# Altium project USB_FPGA_SLM_v2.PrjPcb
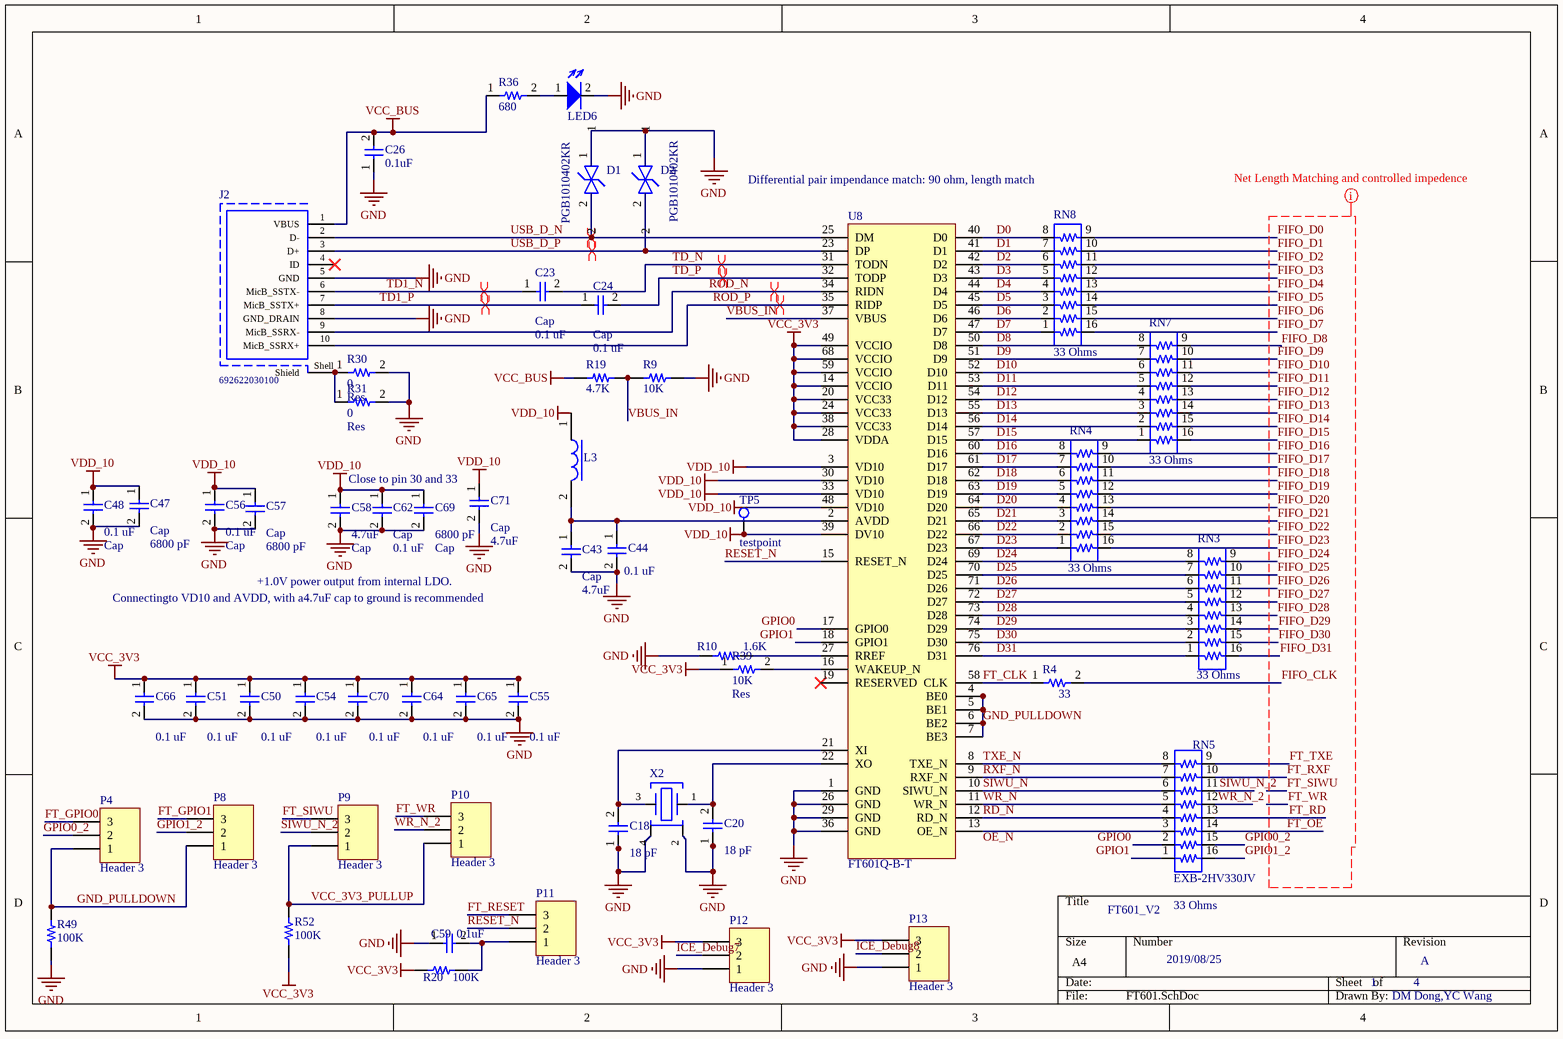
[diagram p0: FT601.SchDoc]
=Title: FPGA
3 sheets, 146 parts. Net scope: global (net labels, ports and power ports of the same name join across sheets).
Board file: PCB_Rev1.1.PcbDoc
Sheets:
  FT601.SchDoc
  FPGA_SLM.SchDoc
  FPGA_Power_SPI.SchDoc

## Sheet FT601.SchDoc: FT601_V2
size A4; Date: 2019/08/25; CheckedBy: A Kadis; Author: DM Dong,YC Wang; CompanyName: CMMPE; DrawnBy: Daoming Dong, Youchao Wang; Revision: A; SheetNumber: 1; SheetTotal: 4

### Parts
C18  value 18 pF  [CAP_18pF_0603]  (hidden comment: C0603C180K5RACAUTO)
C20  value 18 pF  [CAP_18pF_0603]  (hidden comment: C0603C180K5RACAUTO)
C23  value 0.1 uF  Component Name: Cap  [Cap_0.1uF_0402]  (hidden comment: CC0402KPX5R6BB104)
C24  value 0.1 uF  Component Name: Cap  [Cap_0.1uF_0402]  (hidden comment: CC0402KPX5R6BB104)
C26  value 0.1uF  [Cap_0.1uF]  (hidden comment: AC0603KRX7R9BB104)
C43  value 4.7uF  Component Name: Cap  [CAP_4.7uF_0402]  (hidden comment: C1005X5R0J475K050BC)
C44  value 0.1 uF  [Cap_0.1uF_0402]  (hidden comment: CC0402KPX5R6BB104)
C47  value 6800 pF  Component Name: Cap  [CAP_6700pF_0402]  (hidden comment: C0402C682K5RECAUTO)
C48  value 0.1 uF  Component Name: Cap  [Cap_0.1uF_0402]  (hidden comment: CC0402KPX5R6BB104)
C50  value 0.1 uF  [Cap_0.1uF_0402]  (hidden comment: CC0402KPX5R6BB104)
C51  value 0.1 uF  [Cap_0.1uF_0402]  (hidden comment: CC0402KPX5R6BB104)
C54  value 0.1 uF  [Cap_0.1uF_0402]  (hidden comment: CC0402KPX5R6BB104)
C55  value 0.1 uF  [Cap_0.1uF_0402]  (hidden comment: CC0402KPX5R6BB104)
C56  value 0.1 uF  Component Name: Cap  [Cap_0.1uF_0402]  (hidden comment: CC0402KPX5R6BB104)
C57  value 6800 pF  Component Name: Cap  [CAP_6700pF_0402]  (hidden comment: C0402C682K5RECAUTO)
C58  value 4.7uF  Component Name: Cap  [CAP_4.7uF_0402]  (hidden comment: C1005X5R0J475K050BC)
C59  value 0.1uF  [Cap_0.1uF]  (hidden comment: AC0603KRX7R9BB104)
C62  value 0.1 uF  Component Name: Cap  [Cap_0.1uF_0402]  (hidden comment: CC0402KPX5R6BB104)
C64  value 0.1 uF  [Cap_0.1uF_0402]  (hidden comment: CC0402KPX5R6BB104)
C65  value 0.1 uF  [Cap_0.1uF_0402]  (hidden comment: CC0402KPX5R6BB104)
C66  value 0.1 uF  [Cap_0.1uF_0402]  (hidden comment: CC0402KPX5R6BB104)
C69  value 6800 pF  Component Name: Cap  [CAP_6700pF_0402]  (hidden comment: C0402C682K5RECAUTO)
C70  value 0.1 uF  [Cap_0.1uF_0402]  (hidden comment: CC0402KPX5R6BB104)
C71  value 4.7uF  Component Name: Cap  [CAP_4.7uF_0402]  (hidden comment: C1005X5R0J475K050BC)
D1  PGB1010402KR  [ESD_Suppressor]
D2  PGB1010402KR  [ESD_Suppressor]
J2  692622030100  [692622030100]
L3  BLM18PG300SZ1D  [FerriteBeads]  (value not drawn)
LED6  TLMS1000-GS08  [LED_RED]  (value not drawn)
P4  Header 3  [HDR1X3]
P8  Header 3  [HDR1X3]
P9  Header 3  [HDR1X3]
P10  Header 3  [HDR1X3]
P11  Header 3  [HDR1X3]
P12  Header 3  [HDR1X3]
P13  Header 3  [HDR1X3]
R4  value 33  [Res_33_0402]  (hidden comment: ERJ2RKD33R0X)
R9  value 10K  [RES_10K]  (hidden comment: RT0603WRE0710KL)
R10  value 1.6K  [RES_1.6K]  (hidden comment: ERJ-3RBD1601V)
R19  value 4.7K  [RES_4.7K]  (hidden comment: AC0603JR-134K7L)
R20  value 100K  [RES_100K]  (hidden comment: SR0603KR-07100KL)
R30  value 0  Component Name: Res  [RES_0]  (hidden comment: CRCW06030000Z0EAC)
R31  value 0  Component Name: Res  [RES_0]  (hidden comment: CRCW06030000Z0EAC)
R36  value 680  [RES_680]  (hidden comment: RT0603FRE13680RL)
R39  value 10K  Component Name: Res  [RES_10K]  (hidden comment: RT0603WRE0710KL)
R49  value 100K  [RESC1607X60N]  (hidden comment: SR0603KR-07100KL)
R52  value 100K  [RESC1607X60N]  (hidden comment: SR0603KR-07100KL)
RN3  value 33 Ohms  [ResArray_0]  (hidden comment: EXB-2HV330JV)
RN4  value 33 Ohms  [ResArray_0]  (hidden comment: EXB-2HV330JV)
RN5  EXB-2HV330JV  value 33 Ohms  [ResArray_0]
RN7  value 33 Ohms  [ResArray_0]  (hidden comment: EXB-2HV330JV)
RN8  value 33 Ohms  [ResArray_0]  (hidden comment: EXB-2HV330JV)
TP5  testpoint  [testpoint]
U8  FT601Q-B-T  [FT601_NoGND_Pad]
X2  ABM8G-30.000MHZ-18-D2Y-T  [30MHzOscillatorV2]  (value not drawn)

### Nets
GND: C18.1 C20.1 C26.1 C43.2 C44.2 C47.2 C48.2 C50.2 C51.2 C54.2 C55.2 C56.2 C57.2 C58.2 C59.1 C62.2 C64.2 C65.2 C66.2 C69.2 C70.2 C71.2 D1.1 D2.1 J2.5(GND) J2.8(GND_DRAIN) LED6.2(Cathode) P12.1 P13.1 R9.1 R10.1 R30.2 R31.2 R49.1 U8.1(GND) U8.26(GND) U8.29(GND) U8.36(GND) X2.2(GND) X2.4(GND)
VCC_3V3: C50.1 C51.1 C54.1 C55.1 C64.1 C65.1 C66.1 C70.1 P12.3 P13.3 R20.1 R39.1 R52.1 U8.14(VCCIO) U8.20(VCC33) U8.24(VCC33) U8.28(VDDA) U8.38(VCC33) U8.49(VCCIO) U8.59(VCCIO) U8.68(VCCIO)
VCC_BUS: C26.2 J2.1(VBUS) R19.2 R36.1
VDD_10: C47.1 C48.1 C56.1 C57.1 C58.1 C62.1 C69.1 C71.1 L3.1 TP5.1 U8.3(VD10) U8.30(VD10) U8.33(VD10) U8.39(DV10) U8.48(VD10)
D0: RN8.8 U8.40(D0)
D1: RN8.7 U8.41(D1)
D2: RN8.6 U8.42(D2)
D3: RN8.5 U8.43(D3)
D4: RN8.4 U8.44(D4)
D5: RN8.3 U8.45(D5)
D6: RN8.2 U8.46(D6)
D7: RN8.1 U8.47(D7)
D8: RN7.8 U8.50(D8)
D9: RN7.7 U8.51(D9)
D10: RN7.6 U8.52(D10)
D11: RN7.5 U8.53(D11)
D12: RN7.4 U8.54(D12)
D13: RN7.3 U8.55(D13)
D14: RN7.2 U8.56(D14)
D15: RN7.1 U8.57(D15)
D16: RN4.8 U8.60(D16)
D17: RN4.7 U8.61(D17)
D18: RN4.6 U8.62(D18)
D19: RN4.5 U8.63(D19)
D20: RN4.4 U8.64(D20)
D21: RN4.3 U8.65(D21)
D22: RN4.2 U8.66(D22)
D23: RN4.1 U8.67(D23)
D24: RN3.8 U8.69(D24)
D25: RN3.7 U8.70(D25)
D26: RN3.6 U8.71(D26)
D27: RN3.5 U8.72(D27)
D28: RN3.4 U8.73(D28)
D29: RN3.3 U8.74(D29)
D30: RN3.2 U8.75(D30)
D31: RN3.1 U8.76(D31)
FIFO_CLK: R4.2
FIFO_D0: RN8.9
FIFO_D1: RN8.10
FIFO_D2: RN8.11
FIFO_D3: RN8.12
FIFO_D4: RN8.13
FIFO_D5: RN8.14
FIFO_D6: RN8.15
FIFO_D7: RN8.16
FIFO_D8: RN7.9
FIFO_D9: RN7.10
FIFO_D10: RN7.11
FIFO_D11: RN7.12
FIFO_D12: RN7.13
FIFO_D13: RN7.14
FIFO_D14: RN7.15
FIFO_D15: RN7.16
FIFO_D16: RN4.9
FIFO_D17: RN4.10
FIFO_D18: RN4.11
FIFO_D19: RN4.12
FIFO_D20: RN4.13
FIFO_D21: RN4.14
FIFO_D22: RN4.15
FIFO_D23: RN4.16
FIFO_D24: RN3.9
FIFO_D25: RN3.10
FIFO_D26: RN3.11
FIFO_D27: RN3.12
FIFO_D28: RN3.13
FIFO_D29: RN3.14
FIFO_D30: RN3.15
FIFO_D31: RN3.16
FT_CLK: R4.1 U8.58(CLK)
FT_GPIO0: P4.3
FT_GPIO1: P8.3
FT_OE: RN5.14
FT_RD: RN5.13
FT_RESET: P11.3
FT_RXF: RN5.10
FT_SIWU: P9.3
FT_TXE: RN5.9
FT_WR: P10.3
GND_PULLDOWN: P4.1 P8.1 R49.2 U8.4(BE0) U8.5(BE1) U8.6(BE2) U8.7(BE3)
GPIO0: RN5.2 U8.17(GPIO0)
GPIO0_2: P4.2 RN5.15
GPIO1: RN5.1 U8.18(GPIO1)
GPIO1_2: P8.2 RN5.16
ICE_Debug7: P12.2
ICE_Debug8: P13.2
RD_N: RN5.4 U8.12(RD_N)
RESET_N: P11.2 U8.15(RESET_N)
ROD_N: J2.9(MicB_SSRX-) U8.34(RIDN)
ROD_P: J2.10(MicB_SSRX+) U8.35(RIDP)
RXF_N: RN5.7 U8.9(RXF_N)
SIWU_N: RN5.6 U8.10(SIWU_N)
SIWU_N_2: P9.2 RN5.11
TD1_N: C23.1 J2.6(MicB_SSTX-)
TD1_P: C24.1 J2.7(MicB_SSTX+)
TD_N: C23.2 U8.31(TODN)
TD_P: C24.2 U8.32(TODP)
TXE_N: RN5.8 U8.8(TXE_N)
USB_D_N: D1.2 J2.2(D-) U8.25(DM)
USB_D_P: D2.2 J2.3(D+) U8.23(DP)
VBUS_IN: R9.2 R19.1 U8.37(VBUS)
VCC_3V3_PULLUP: P9.1 P10.1 R52.2
WR_N: RN5.5 U8.11(WR_N)
WR_N_2: P10.2 RN5.12
NetC18_2: C18.2 U8.21(XI) X2.3(HOT)
NetC20_2: C20.2 U8.22(XO) X2.1(HOT)
NetC43_1: C43.1 C44.1 L3.2 U8.2(AVDD)
NetC59_2: C59.2 P11.1 R20.2
NetJ2_Shell: J2.Shell(Shield) R30.1 R31.1
NetLED6_1: LED6.1(Anode) R36.2
NetR10_2: R10.2 U8.27(RREF)
NetR39_2: R39.2 U8.16(WAKEUP_N)
NetRN5_3: RN5.3 U8.13(OE_N)

Not connected (* = marked no-connect by the designer): J2 4(ID)*; U8 19(RESERVED)*

### Layout directives
differential pair; differential pair class Diff90: ROD_N, ROD_P, TD1_N, TD1_P, TD_N, TD_P, USB_D_N, USB_D_P
rule Matched Net Lengths [Tolerance = 24.5mm]; net class FT601FIFO: FIFO_CLK, FIFO_D0, FIFO_D1, FIFO_D2, FIFO_D3, FIFO_D4, FIFO_D5, FIFO_D6, FIFO_D7, FIFO_D8, FIFO_D9, FIFO_D10, FIFO_D11, FIFO_D12, FIFO_D13, FIFO_D14, FIFO_D15, FIFO_D16, FIFO_D17, FIFO_D18, FIFO_D19, FIFO_D20, FIFO_D21, FIFO_D22, FIFO_D23, FIFO_D24, FIFO_D25, FIFO_D26, FIFO_D27, FIFO_D28, FIFO_D29, FIFO_D30, FIFO_D31, FT_OE, FT_RD, FT_RXF, FT_SIWU, FT_TXE, FT_WR

### Notes on the sheet
- Differential pair impendance match: 90 ohm, length match
- Close to pin 30 and 33
- +1.0V power output from internal LDO.
- Connectingto VD10 and AVDD, with a4.7uF cap to ground is recommended
- Labels drawn without touching a wire or pin: OE_N

### Library data of the parts
C18 C20 = Cap_18pF_0603: Multilayer Ceramic Capacitors MLCC - SMD/SMT 50V 18pF 0603 X7R 10% AEC-Q200; Manufacture: KEMET; Component Name: Cap; Manufacture No.: C0603C180K5RACAUTO; Mouser No.: 80-C0603C180K5RAUTO; Case Code: 0603; Datasheet URL.: https://www.mouser.co.uk/datasheet/2/212/KEM_C1023_X7R_AUTO_SMD-1093309.pdf
C23 C24 C48 C56 C62 = CAP_0.1uF_0402: Multilayer Ceramic Capacitors MLCC - SMD/SMT 100nF 10V X5R 10%; Manufacture: Yageo; Date Created: 11-Mar-2019; Created By: Daoming Dong; Manufacture No.: CC0402KPX5R6BB104; Mouser No.: 603-CC402KPX5R6BB104; Case Code: 0402; Datasheet URL.: https://www.mouser.co.uk/datasheet/2/447/UPY-GPHC_X5R_4V-to-50V_25-1131599.pdf
C26 C59 = Cap_0.1uF: Multilayer Ceramic Capacitors MLCC - SMD/SMT 0.1uF 10% 50V AEC-Q200; Component Name: Cap; Date Created: 01-Mar-2019; Created By: Daoming Dong; Datasheet URL: https://www.mouser.co.uk/datasheet/2/447/UPY-AC_NP0X7R_16V-to-630V_11-1511105.pdf; Package: 0603; Manufacture No.: AC0603KRX7R9BB104; Mouser No.: 603-AC0603KR9BB104
C43 C58 C71 = Cap_4.7uF_0402: Multilayer Ceramic Capacitors MLCC - SMD/SMT 0402 6.3V 4.7uF X5R 10% T: 0.5mm; Manufactue: TDK; Date Created: 13-Mar-2019; Created By: Daoming Dong; Manufacture No.: C1005X5R0J475K050BC; Mouser No.: 810-C1005X5R0J475K; Case Code: 0402; Datasheet URL.: https://www.mouser.co.uk/datasheet/2/400/lcc_commercial_general_en-837201.pdf
C44 C50 C51 C54 C55 C64-C66 C70 = CAP_0.1uF_0402: Multilayer Ceramic Capacitors MLCC - SMD/SMT 100nF 10V X5R 10%; Manufacture: Yageo; Component Name: Cap; Date Created: 11-Mar-2019; Created By: Daoming Dong; Manufacture No.: CC0402KPX5R6BB104; Mouser No.: 603-CC402KPX5R6BB104; Case Code: 0402; Datasheet URL.: https://www.mouser.co.uk/datasheet/2/447/UPY-GPHC_X5R_4V-to-50V_25-1131599.pdf
C47 C57 C69 = Cap_6800pF_0402: Multilayer Ceramic Capacitors MLCC - SMD/SMT 50V 6800pF X7R 0402 10% AEC-Q200; Manufacture: KEMET; Date Created: 18-Mar-2019; Created By: Daoming Dong; Manufacture No.: C0402C682K5RECAUTO; Mouser No.: 80-C0402C682K5RECAUT; Case Code: 0402; Datasheet URL.: https://www.mouser.co.uk/datasheet/2/212/KEM_C1090_X7R_ESD-1103328.pdf
D1 D2 = ESD_Suppresor: ESD Suppressors / TVS Diodes PULSEGUARD 0402 ESD SUPPRESSOR; Manufacature: Littelfuse; Manufacture No.: PGB1010402KR; Mouser No.: 576-PGB1010402KR; Date Created: 12-Mar-2019; Created By: Daoming Dong; Component Name: ESD Suppressor; Datasheet URL.: https://www.mouser.co.uk/datasheet/2/240/Littelfuse_PulseGuard_PGB1_Datasheet.pdf-461684.pdf; Case Code: 0402
J2 = 692622030100: Micro USB 3.0 Type B Receptacle WR-COM, Horizontal, SMT, with Pads; Rated Current: 0.25 A; Contact Resistance: 50 mOhm; Working Voltage: 30 VAC; ComponentLink1Description: Manufacturer; ComponentLink1URL: http://www.we-online.de; ComponentLink2Description: Datasheet; ComponentLink2URL: https://katalog.we-online.de/em/datasheet/692622030100.pdf; Part Number: 692622030100; Published Date: September 2018; Publisher: Wurth Elektronik; Orientation: Horizontal; Connector Type: Micro USB 3.0 Type B; Operating Temperature: -20 to 85 degC; Mounting Technology: SMT; Gender: Receptacle; Packaging: Tape and Reel
L3 = FerriteBeadForFT601: Ferrite Beads 0603 30ohms 1000mA Auto Infotainment; Manufacture: muRata; Value: 30R@100MHz/1A; Component Name: Ferrite Beads; Manufacture No.: BLM18PG300SZ1D; Mouser No.: 81-BLM18PG300SZ1D; Datasheet URL.: https://www.mouser.co.uk/datasheet/2/281/c51e-794816.pdf; Created By: Daoming Dong; Data Created: 25th-Mar-2019; Case Code: 0603
LED6 = LED_RED: Standard LEDs - SMD RED; Component Name: LED_R; Vf: 1.8V; Created By: Daoming Dong; Date Created: 11-Mar-2018; Manufacture No.: TLMS1000-GS08; Mouser No.: 78-TLMS1000; Case Code: 0603; Datasheet URL.: https://www.mouser.co.uk/datasheet/2/427/tlmb1100-279843.pdf
P4 P8-P13 = Header 3: Header, 3-Pin; LatestRevisionDate: 17-Jul-2002; LatestRevisionNote: Re-released for DXP Platform.; Publisher: Altium Limited
R4 = Res_33_0402: Thick Film Resistors - SMD 0402 Resistor 0.5% 100ppm 33Ohm; Manufacture: Panasonic; Created By.: Daoming Dong; Component Name: Res; Manufcature No.: ERJ2RKD33R0X; Mouser No.: 667-ERJ-2RKD33R0X; Date Created: 12-Mar-2019; Datasheet URL.: https://www.mouser.co.uk/datasheet/2/315/AOA0000C304-1149620.pdf; Case Code: 0402
R9 = Res_10K: Thin Film Resistors - SMD 10K ohm 0.05% 50 ppm High-Precision; Manufacture: Yageo; Component Name: Res; Manufacture No.: RT0603WRE0710KL; Mouser No.: 603-RT0603WRE0710KL; Created By: Daoming Dong; Date Created: 02-Mar-2019; Datasheet URL.: https://www.mouser.co.uk/datasheet/2/447/PYu-RT_1-to-0.01_RoHS_L_9-1222720.pdf; Case Code: 0603
R10 = Res_1.6K: Thick Film Resistors - SMD 0603 Resistor 0.5% 50ppm 1.6KOhm; Manufacture: Panasonic; Component Name: Res; Created By: Daoming Dong; Date Created: 02-Mar-2019; Manufacture No.: ERJ-3RBD1601V; Mouser No.: 667-ERJ-3RBD1601V; Case Code: 0603; Datasheet URL.: https://www.mouser.co.uk/datasheet/2/315/AOA0000C304-1149620.pdf
R19 = Res_4.7K: Thick Film Resistors - SMD 4.7K ohm 5% 1/10W AEC-Q200; Manufacture: Yageo; Component Name: Res; Manufacture No.: AC0603JR-134K7L; Mouser No.: 603-AC0603JR-134K7L; Created By: Daoming Dong; Date Created: 02-Mar-2019; Case Code: 0603; Datasheet URL.: https://www.mouser.co.uk/datasheet/2/447/PYu-AC_51_RoHS_L_6-1152827.pdf
R20 R49 R52 = Res_100K: Thick Film Resistors - SMD 100K ohm 10% 75V AEC-Q200; Manufacture: Yageo; Component Name: Res; Manufacture No.: SR0603KR-07100KL; Mouser No.: 603-SR0603KR-07100KL; Date Created: 02-Mar-2019; Created By: Daoming Dong; Datasheet URL.: https://www.mouser.co.uk/datasheet/2/447/PYu-SR_20105_RoHS_L_7-1488668.pdf; Case Code: 0603
R30 R31 = Res_0: Thick Film Resistors - SMD 1/10Watt 0ohms Commercial Use; Manufacture: Vishay; Case Code: 0603; Manufacture No.: CRCW06030000Z0EAC; Mouser No.: 71-CRCW06030000Z0EAC; Created By: Daoming Dong; Date Created: 02-Mar-2019; Datasheet URL.: https://www.mouser.co.uk/datasheet/2/427/crcwce3-1223726.pdf
R36 = Res_680: Thin Film Resistors - SMD 680 ohm 1% 50 ppm Thin Film; Manufacture: Yageo; Component Name: Res; Manufacture No.: RT0603FRE13680RL; Mouser No.: 603-RT0603FRE13680RL; Created By: Daoming Dong; Date Created: 02-Mar-2019; Datasheet URL.: https://www.mouser.co.uk/datasheet/2/447/PYu-RT_1-to-0.01_RoHS_L_9-1222720.pdf; Case Code: 0603
R39 = Res_10K: Thin Film Resistors - SMD 10K ohm 0.05% 50 ppm High-Precision; Manufacture: Yageo; Manufacture No.: RT0603WRE0710KL; Mouser No.: 603-RT0603WRE0710KL; Created By: Daoming Dong; Date Created: 02-Mar-2019; Datasheet URL.: https://www.mouser.co.uk/datasheet/2/447/PYu-RT_1-to-0.01_RoHS_L_9-1222720.pdf; Case Code: 0603
RN3-RN5 RN7 RN8 = ResArray: Resistor Networks & Arrays 33 OHM 5%; Component Name: Resistor Array; Manufacture No.: EXB-2HV330JV; Mouser No.: 667-EXB-2HV330JV; Datasheet URL.: https://www.mouser.co.uk/datasheet/2/315/AOC0000C14-1108062.pdf; Date Created: 11-Mar-2019
TP5 = Testpoint: Testpoint for testing voltage; Created By: Daoming Dong; Date Created: 11-Mar-2019
U8 = FT601Q-B-T: USB Interface IC USB 3.0 Super-Speed 32Bits Sync FIFO; Created By: Daoming Dong; Farnell Order Code: 2748207; Manufacture Part No.: FT601Q-B-T; RS Stock No.: 146-6840; Date Created: 25th Feb 2019; Datasheet URL: http://www.farnell.com/datasheets/2263949.pdf
X2 = 30MHzOscillator: Crystals 30.000MHz 18pF 30ppm -40C +85C; Created By: Youchao Wang; Date Created: 29th Aug 2019; Manufacture No.: ABM8G-30.000MHZ-18-D2Y-T; Datasheet URL.: https://www.mouser.co.uk/datasheet/2/3/ABM8G-10572.pdf; Mouser Stock No.: 815-ABM8G-30-18D2Y; Component Name: 30MHz Oscillator

## Sheet FPGA_SLM.SchDoc: FPGA_SLM_V2
size A4; Date: 2019/08/25; CheckedBy: A Kadis; Author: DM Dong, YC Wang; CompanyName: CMMPE; DrawnBy: Daoming Dong, Youchao Wang; Revision: B; SheetNumber: 3; SheetTotal: 4
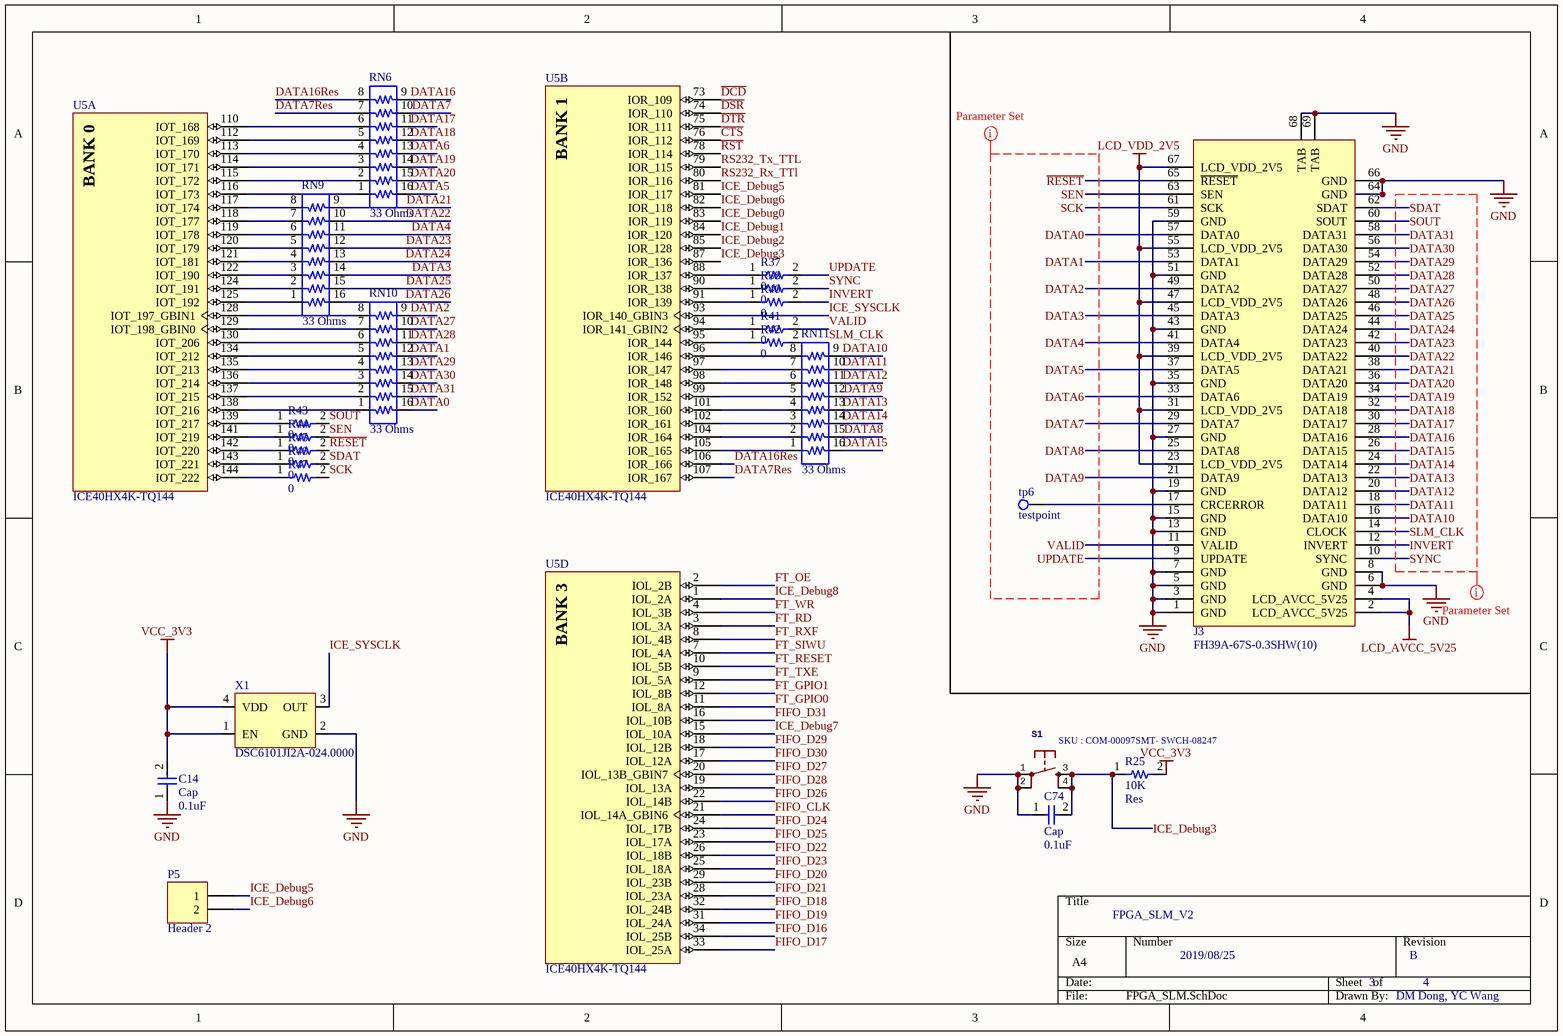
[diagram p1: FPGA_SLM.SchDoc]

### Parts
C14  value 0.1uF  Component Name: Cap  [Cap_0.1uF]  (hidden comment: AC0603KRX7R9BB104)
C74  value 0.1uF  Component Name: Cap  [Cap_0.1uF]  (hidden comment: AC0603KRX7R9BB104)
J3  FH39A-67S-0.3SHW(10)  [Hirose_connector]
P5  Header 2  [HDR1X2]
R25  value 10K  Component Name: Res  [RES_10K]  (hidden comment: RT0603WRE0710KL)
R37  value 0  [RES_0]  (hidden comment: CRCW06030000Z0EAC)
R38  value 0  [RES_0]  (hidden comment: CRCW06030000Z0EAC)
R40  value 0  [RES_0]  (hidden comment: CRCW06030000Z0EAC)
R41  value 0  [RES_0]  (hidden comment: CRCW06030000Z0EAC)
R42  value 0  [RES_0]  (hidden comment: CRCW06030000Z0EAC)
R43  value 0  [RES_0]  (hidden comment: CRCW06030000Z0EAC)
R44  value 0  [RES_0]  (hidden comment: CRCW06030000Z0EAC)
R45  value 0  [RES_0]  (hidden comment: CRCW06030000Z0EAC)
R46  value 0  [RES_0]  (hidden comment: CRCW06030000Z0EAC)
R47  value 0  [RES_0]  (hidden comment: CRCW06030000Z0EAC)
RN6  value 33 Ohms  [ResArray_0]  (hidden comment: EXB-2HV330JV)
RN9  value 33 Ohms  [ResArray_0]  (hidden comment: EXB-2HV330JV)
RN10  value 33 Ohms  [ResArray_0]  (hidden comment: EXB-2HV330JV)
RN11  value 33 Ohms  [ResArray_0]  (hidden comment: EXB-2HV330JV)
S1  SKU : COM-00097SMT- SWCH-08247  [TACTILE-PTH]
tp6  testpoint  [testpoint]
U5  ICE40HX4K-TQ144  [LATC-TQFP-144_L]  (parts A,B,D of 5)
X1  DSC6101JI2A-024.0000  [24MHzOscillator]

### Nets
GND: C14.1 C74.1 J3.1(GND) J3.3(GND) J3.5(GND) J3.6(GND) J3.7(GND) J3.8(GND) J3.13(GND) J3.15(GND) J3.19(GND) J3.27(GND) J3.35(GND) J3.43(GND) J3.51(GND) J3.59(GND) J3.64(GND) J3.66(GND) J3.68(TAB) J3.69(TAB) S1.1 S1.2 X1.2(GND)
ICE_Debug0: U5.83(IOR_119)
ICE_Debug1: U5.84(IOR_120)
ICE_Debug2: U5.85(IOR_128)
LCD_AVCC_5V25: J3.2(LCD_AVCC_5V25) J3.4(LCD_AVCC_5V25)
LCD_VDD_2V5: J3.23(LCD_VDD_2V5) J3.31(LCD_VDD_2V5) J3.39(LCD_VDD_2V5) J3.47(LCD_VDD_2V5) J3.55(LCD_VDD_2V5) J3.67(LCD_VDD_2V5)
VCC_3V3: C14.2 R25.2 X1.1(EN) X1.4(VDD)
~{CTS}: U5.76(IOR_112)
~{DCD}: U5.73(IOR_109)
~{DSR}: U5.74(IOR_110)
~{DTR}: U5.75(IOR_111)
DATA0: J3.57(DATA0) RN10.16
DATA1: J3.53(DATA1) RN10.12
DATA2: J3.49(DATA2) RN10.9
DATA3: J3.45(DATA3) RN9.14
DATA4: J3.41(DATA4) RN9.11
DATA5: J3.37(DATA5) RN6.16
DATA6: J3.33(DATA6) RN6.13
DATA7: J3.29(DATA7) RN6.10
DATA7Res: RN6.7 U5.107(IOR_167)
DATA8: J3.25(DATA8) RN11.15
DATA9: J3.21(DATA9) RN11.12
DATA10: J3.16(DATA10) RN11.9
DATA11: J3.18(DATA11) RN11.10
DATA12: J3.20(DATA12) RN11.11
DATA13: J3.22(DATA13) RN11.13
DATA14: J3.24(DATA14) RN11.14
DATA15: J3.26(DATA15) RN11.16
DATA16: J3.28(DATA16) RN6.9
DATA16Res: RN6.8 U5.106(IOR_166)
DATA17: J3.30(DATA17) RN6.11
DATA18: J3.32(DATA18) RN6.12
DATA19: J3.34(DATA19) RN6.14
DATA20: J3.36(DATA20) RN6.15
DATA21: J3.38(DATA21) RN9.9
DATA22: J3.40(DATA22) RN9.10
DATA23: J3.42(DATA23) RN9.12
DATA24: J3.44(DATA24) RN9.13
DATA25: J3.46(DATA25) RN9.15
DATA26: J3.48(DATA26) RN9.16
DATA27: J3.50(DATA27) RN10.10
DATA28: J3.52(DATA28) RN10.11
DATA29: J3.54(DATA29) RN10.13
DATA30: J3.56(DATA30) RN10.14
DATA31: J3.58(DATA31) RN10.15
FIFO_CLK: U5.21(IOL_14A_GBIN6)
FIFO_D16: U5.34(IOL_25B)
FIFO_D17: U5.33(IOL_25A)
FIFO_D18: U5.32(IOL_24B)
FIFO_D19: U5.31(IOL_24A)
FIFO_D20: U5.29(IOL_23B)
FIFO_D21: U5.28(IOL_23A)
FIFO_D22: U5.26(IOL_18B)
FIFO_D23: U5.25(IOL_18A)
FIFO_D24: U5.24(IOL_17B)
FIFO_D25: U5.23(IOL_17A)
FIFO_D26: U5.22(IOL_14B)
FIFO_D27: U5.20(IOL_13B_GBIN7)
FIFO_D28: U5.19(IOL_13A)
FIFO_D29: U5.18(IOL_12B)
FIFO_D30: U5.17(IOL_12A)
FIFO_D31: U5.16(IOL_10B)
FT_GPIO0: U5.11(IOL_8A)
FT_GPIO1: U5.12(IOL_8B)
FT_OE: U5.2(IOL_2B)
FT_RD: U5.3(IOL_3A)
FT_RESET: U5.10(IOL_5B)
FT_RXF: U5.8(IOL_4B)
FT_SIWU: U5.7(IOL_4A)
FT_TXE: U5.9(IOL_5A)
FT_WR: U5.4(IOL_3B)
ICE_Debug3: C74.2 R25.1 S1.3 S1.4 U5.87(IOR_136)
ICE_Debug5: P5.1 U5.81(IOR_117)
ICE_Debug6: P5.2 U5.82(IOR_118)
ICE_Debug7: U5.15(IOL_10A)
ICE_Debug8: U5.1(IOL_2A)
ICE_SYSCLK: U5.93(IOR_140_GBIN3) X1.3(OUT)
INVERT: J3.12(INVERT) R40.2
~{RESET}: J3.65(~{RESET}) R45.2
~{RST}: U5.78(IOR_114)
RS232_Rx_TTl: U5.80(IOR_116)
RS232_Tx_TTL: U5.79(IOR_115)
SCK: J3.61(SCK) R47.2
SDAT: J3.62(SDAT) R46.2
SEN: J3.63(SEN) R44.2
SLM_CLK: J3.14(CLOCK) R42.2
SOUT: J3.60(SOUT) R43.2
SYNC: J3.10(SYNC) R38.2
UPDATE: J3.9(UPDATE) R37.2
VALID: J3.11(VALID) R41.2
NetJ3_17: J3.17(CRCERROR) tp6.1
NetR37_1: R37.1 U5.88(IOR_137)
NetR38_1: R38.1 U5.90(IOR_138)
NetR40_1: R40.1 U5.91(IOR_139)
NetR41_1: R41.1 U5.94(IOR_141_GBIN2)
NetR42_1: R42.1 U5.95(IOR_144)
NetR43_1: R43.1 U5.139(IOT_217)
NetR44_1: R44.1 U5.141(IOT_219)
NetR45_1: R45.1 U5.142(IOT_220)
NetR46_1: R46.1 U5.143(IOT_221)
NetR47_1: R47.1 U5.144(IOT_222)
NetRN6_1: RN6.1 U5.116(IOT_173)
NetRN6_2: RN6.2 U5.115(IOT_172)
NetRN6_3: RN6.3 U5.114(IOT_171)
NetRN6_4: RN6.4 U5.113(IOT_170)
NetRN6_5: RN6.5 U5.112(IOT_169)
NetRN6_6: RN6.6 U5.110(IOT_168)
NetRN9_1: RN9.1 U5.125(IOT_192)
NetRN9_2: RN9.2 U5.124(IOT_191)
NetRN9_3: RN9.3 U5.122(IOT_190)
NetRN9_4: RN9.4 U5.121(IOT_181)
NetRN9_5: RN9.5 U5.120(IOT_179)
NetRN9_6: RN9.6 U5.119(IOT_178)
NetRN9_7: RN9.7 U5.118(IOT_177)
NetRN9_8: RN9.8 U5.117(IOT_174)
NetRN10_1: RN10.1 U5.138(IOT_216)
NetRN10_2: RN10.2 U5.137(IOT_215)
NetRN10_3: RN10.3 U5.136(IOT_214)
NetRN10_4: RN10.4 U5.135(IOT_213)
NetRN10_5: RN10.5 U5.134(IOT_212)
NetRN10_6: RN10.6 U5.130(IOT_206)
NetRN10_7: RN10.7 U5.129(IOT_198_GBIN0)
NetRN10_8: RN10.8 U5.128(IOT_197_GBIN1)
NetRN11_1: RN11.1 U5.105(IOR_165)
NetRN11_2: RN11.2 U5.104(IOR_164)
NetRN11_3: RN11.3 U5.102(IOR_161)
NetRN11_4: RN11.4 U5.101(IOR_160)
NetRN11_5: RN11.5 U5.99(IOR_152)
NetRN11_6: RN11.6 U5.98(IOR_148)
NetRN11_7: RN11.7 U5.97(IOR_147)
NetRN11_8: RN11.8 U5.96(IOR_146)

### Layout directives
rule Matched Net Lengths [Tolerance = 5mm]; net class SLM: DATA0, DATA1, DATA2, DATA3, DATA4, DATA5, DATA6, DATA7, DATA8, DATA9, DATA10, DATA11, DATA12, DATA13, DATA14, DATA15, DATA16, DATA17, DATA18, DATA19, DATA20, DATA21, DATA22, DATA23, DATA24, DATA25, DATA26, DATA27, DATA28, DATA29, DATA30, DATA31, INVERT, SCK, SDAT, SEN, SLM_CLK, SOUT, SYNC, UPDATE, VALID, ~{RESET}

### Notes on the sheet
- (in symbol ICE40HX4K-TQ144, part A) BANK 0
- (in symbol ICE40HX4K-TQ144, part B) BANK 1
- (in symbol ICE40HX4K-TQ144, part D) BANK 3

### Library data of the parts
C14 C74 = Cap_0.1uF: Multilayer Ceramic Capacitors MLCC - SMD/SMT 0.1uF 10% 50V AEC-Q200; Date Created: 01-Mar-2019; Created By: Daoming Dong; Datasheet URL: https://www.mouser.co.uk/datasheet/2/447/UPY-AC_NP0X7R_16V-to-630V_11-1511105.pdf; Package: 0603; Manufacture No.: AC0603KRX7R9BB104; Mouser No.: 603-AC0603KR9BB104
J3 = FH39A-67S-0.3SHW(10): FFC & FPC Connectors FPC ZIF CONN 67 POS SMT HORZ MNT; Manufacture: Hirose Connector; Component Name: Hirose Connector FH39A-67S-0.3SHW(10); Manufacture No.: FH39A-67S-0.3SHW(10); Mouser No.: 798-FH39A-67S-0.3SHW(10); Created By: Daoming Dong; Date Created: 05-Mar-2019; Datasheet URL.: https://www.mouser.co.uk/datasheet/2/185/_catalog-939287.pdf
P5 = Header 2: Header, 2-Pin; LatestRevisionDate: 17-Jul-2002; LatestRevisionNote: Re-released for DXP Platform.; Publisher: Altium Limited
R25 = Res_10K: as R39 on sheet FT601; Manufacture No.: RT0603WRE0710KL; Mouser No.: 603-RT0603WRE0710KL; Created By: Daoming Dong; Date Created: 02-Mar-2019; Datasheet URL.: https://www.mouser.co.uk/datasheet/2/447/PYu-RT_1-to-0.01_RoHS_L_9-1222720.pdf; Case Code: 0603
R37 R38 R40-R47 = Res_0: Thick Film Resistors - SMD 1/10Watt 0ohms Commercial Use; Manufacture: Vishay; Component Name: Res; Case Code: 0603; Manufacture No.: CRCW06030000Z0EAC; Mouser No.: 71-CRCW06030000Z0EAC; Created By: Daoming Dong; Date Created: 02-Mar-2019; Datasheet URL.: https://www.mouser.co.uk/datasheet/2/427/crcwce3-1223726.pdf
RN6 RN9-RN11 = ResArray: as RN3 on sheet FT601; Manufacture No.: EXB-2HV330JV; Mouser No.: 667-EXB-2HV330JV; Date Created: 11-Mar-2019; Datasheet URL.: https://www.mouser.co.uk/datasheet/2/315/AOC0000C14-1108062.pdf
S1 = TAC_SWITCHPTH: GateName_1: S; SymbolName_1: SWITCH-MOMENTARY; DeviceName: PTH; LibraryName: SparkFun-Electromechanical; DeviceSetName: TAC_SWITCH; Package: TACTILE-PTH
tp6 = Testpoint: Testpoint for testing voltage; Created By: Daoming Dong; Date Created: 11-Mar-2019
U5 = ICE40HX4K-TQ144: iCE40 HX4K Series FPGA Family, 3520 Logic Cells, 1.2 V Core, 80 K Embedded RAM Bits, 144-pin TQFP, Pb-Free, Tray; Manufacturer: Lattice Semiconductor; Embedded RAM Bits: 80K; Logic Cells: 3520; Phase-Locked Loops: 2; Supply Voltage: 1.2V; DatasheetVersion: Rev. 02.9; PackageVersion: Rev. 03.9, 02/2013; PackageReference: TQFP-144; PackageDescription: 144-Pin Thin Quad Flat Package, Body 20 x 20 mm, Pitch 0.5 mm; Supplier 1: Digi-Key; Supplier Part Number 1: 220-1572-ND; Supplier 2: Mouser; Supplier Part Number 2: 842-ICE40HX4K-TQ144; Packing: Tray; RoHS: TRUE; Mounting Technology: Surface Mount; PartNumber: ICE40HX4K-TQ144; ComponentLink1Description: Manufacturer URL; ComponentLink1URL: http://www.latticesemi.com/en; ComponentLink2Description: Datasheet; ComponentLink2URL: http://www.latticesemi.com/~/media/Documents/DataSheets/iCE/iCE40LPHXFamilyDataSheet.pdf; ComponentLink3Description: Package Specification; ComponentLink3URL: http://www.latticesemi.com/lit/docs/package/pkg.pdf
X1 = 24MHzOscillator: Standard Clock Oscillators MEMS Oscillator, Ultra Low Power, LVCMOS, -40C-85C, 25ppm, 2.5x2.0mm; Manufacture: Microchip; Frequency: 24 MHz; Created By: Daoming Dong; Date Created: 12-Mar-2019; Manufacture No.: DSC6101JI2A-024.0000; Mouser No.: 579-C6101JI2A0240000; Frequency Stability: 25 PPM; Datasheet URL.: https://www.mouser.co.uk/datasheet/2/268/20005624B-1149202.pdf

## Sheet FPGA_Power_SPI.SchDoc: FPGA_PWR_SPI_V2
size A4; Date: 2019/08/25; CheckedBy: A Kadis; Author: DM Dong, YC Wang; CompanyName: CMMPE; DrawnBy: Daoming Dong, Youchao Wang; Revision: A; SheetNumber: 4; SheetTotal: 4
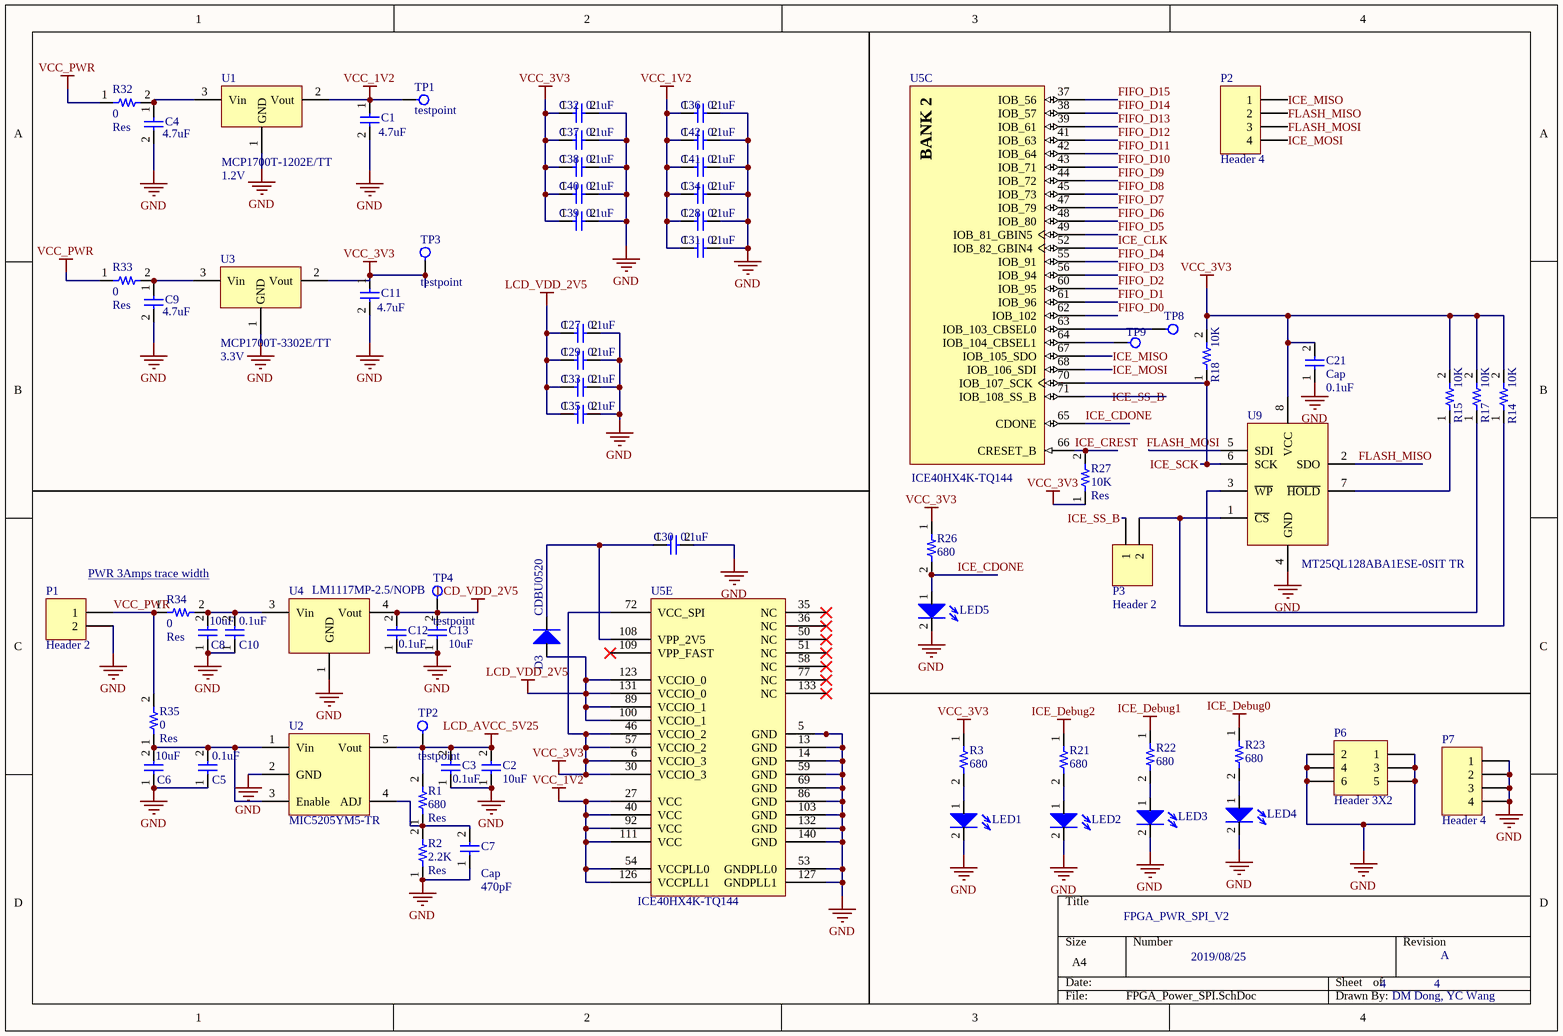
[diagram p2: FPGA_Power_SPI.SchDoc]

### Parts
C1  value 4.7uF  [Cap_4.7uF]  (hidden comment: C0603C475K9PAC7411)
C2  value 10uF  [Cap_10uF]  (hidden comment: C1608X5R0J106K080AE)
C3  value 0.1uF  [Cap_0.1uF]  (hidden comment: AC0603KRX7R9BB104)
C4  value 4.7uF  [Cap_4.7uF]  (hidden comment: C0603C475K9PAC7411)
C5  value 0.1uF  [Cap_0.1uF]  (hidden comment: AC0603KRX7R9BB104)
C6  value 10uF  [Cap_10uF]  (hidden comment: C1608X5R0J106K080AE)
C7  value 470pF  Component Name: Cap  [CAP_470pF]  (hidden comment: C0402S471K3RACAUTO)
C8  value 10uF  [Cap_10uF]  (hidden comment: C1608X5R0J106K080AE)
C9  value 4.7uF  [Cap_4.7uF]  (hidden comment: C0603C475K9PAC7411)
C10  value 0.1uF  [Cap_0.1uF]  (hidden comment: AC0603KRX7R9BB104)
C11  value 4.7uF  [Cap_4.7uF]  (hidden comment: C0603C475K9PAC7411)
C12  value 0.1uF  [Cap_0.1uF]  (hidden comment: AC0603KRX7R9BB104)
C13  value 10uF  [Cap_10uF]  (hidden comment: C1608X5R0J106K080AE)
C21  value 0.1uF  Component Name: Cap  [Cap_0.1uF]  (hidden comment: AC0603KRX7R9BB104)
C27  value 0.1uF  [Cap_0.1uF]  (hidden comment: AC0603KRX7R9BB104)
C28  value 0.1uF  [Cap_0.1uF]  (hidden comment: AC0603KRX7R9BB104)
C29  value 0.1uF  [Cap_0.1uF]  (hidden comment: AC0603KRX7R9BB104)
C30  value 0.1uF  [Cap_0.1uF]  (hidden comment: AC0603KRX7R9BB104)
C31  value 0.1uF  [Cap_0.1uF]  (hidden comment: AC0603KRX7R9BB104)
C32  value 0.1uF  [Cap_0.1uF]  (hidden comment: AC0603KRX7R9BB104)
C33  value 0.1uF  [Cap_0.1uF]  (hidden comment: AC0603KRX7R9BB104)
C34  value 0.1uF  [Cap_0.1uF]  (hidden comment: AC0603KRX7R9BB104)
C35  value 0.1uF  [Cap_0.1uF]  (hidden comment: AC0603KRX7R9BB104)
C36  value 0.1uF  [Cap_0.1uF]  (hidden comment: AC0603KRX7R9BB104)
C37  value 0.1uF  [Cap_0.1uF]  (hidden comment: AC0603KRX7R9BB104)
C38  value 0.1uF  [Cap_0.1uF]  (hidden comment: AC0603KRX7R9BB104)
C39  value 0.1uF  [Cap_0.1uF]  (hidden comment: AC0603KRX7R9BB104)
C40  value 0.1uF  [Cap_0.1uF]  (hidden comment: AC0603KRX7R9BB104)
C41  value 0.1uF  [Cap_0.1uF]  (hidden comment: AC0603KRX7R9BB104)
C42  value 0.1uF  [Cap_0.1uF]  (hidden comment: AC0603KRX7R9BB104)
D3  CDBU0520  [SchottkyDiode_CDBU0520]
LED1  TLMS1000-GS08  [LED_RED]  (value not drawn)
LED2  TLMS1000-GS08  [LED_RED]  (value not drawn)
LED3  TLMS1000-GS08  [LED_RED]  (value not drawn)
LED4  TLMS1000-GS08  [LED_RED]  (value not drawn)
LED5  TLMS1000-GS08  [LED_RED]  (value not drawn)
P1  Header 2  [HDR1X2]
P2  Header 4  [HDR2X2]
P3  Header 2  [HDR1X2]
P6  Header 3X2  [HDR2X3]
P7  Header 4  [HDR2X2]
R1  value 680  Component Name: Res  [RES_680]  (hidden comment: RT0603FRE13680RL)
R2  value 2.2K  Component Name: Res  [RES_2.2K]  (hidden comment: CRCW06032K20JNEAC)
R3  value 680  [RES_680]  (hidden comment: RT0603FRE13680RL)
R14  value 10K  [RES_10K]  (hidden comment: RT0603WRE0710KL)
R15  value 10K  [RES_10K]  (hidden comment: RT0603WRE0710KL)
R17  value 10K  [RES_10K]  (hidden comment: RT0603WRE0710KL)
R18  value 10K  [RES_10K]  (hidden comment: RT0603WRE0710KL)
R21  value 680  [RES_680]  (hidden comment: RT0603FRE13680RL)
R22  value 680  [RES_680]  (hidden comment: RT0603FRE13680RL)
R23  value 680  [RES_680]  (hidden comment: RT0603FRE13680RL)
R26  value 680  [RES_680]  (hidden comment: RT0603FRE13680RL)
R27  value 10K  Component Name: Res  [RES_10K]  (hidden comment: RT0603WRE0710KL)
R32  value 0  Component Name: Res  [RES_0]  (hidden comment: CRCW06030000Z0EAC)
R33  value 0  Component Name: Res  [RES_0]  (hidden comment: CRCW06030000Z0EAC)
R34  value 0  Component Name: Res  [RES_0]  (hidden comment: CRCW06030000Z0EAC)
R35  value 0  Component Name: Res  [RES_0]  (hidden comment: CRCW06030000Z0EAC)
TP1  testpoint  [testpoint]
TP2  testpoint  [testpoint]
TP3  testpoint  [testpoint]
TP4  testpoint  [testpoint]
TP8  Testpoint  [testpoint]  (value not drawn)
TP9  Testpoint  [testpoint]  (value not drawn)
U1  MCP1700T-1202E/TT  value 1.2V  [MIC_LDO_1V2]
U2  MIC5205YM5-TR  [MIC5205YM5]
U3  MCP1700T-3302E/TT  value 3.3V  [MIC_LDO_3V3]
U4  LM1117MP-2.5/NOPB  [LM1117MP-2.5/NOPB]
U5  ICE40HX4K-TQ144  [LATC-TQFP-144_L]  (parts C,E of 5)
U9  MT25QL128ABA1ESE-0SIT TR  [Flash]

### Nets
GND: C1.2 C2.1 C3.1 C4.2 C5.1 C6.1 C7.1 C8.1 C9.2 C10.1 C11.2 C12.1 C13.1 C21.1 C27.2 C28.2 C29.2 C30.2 C31.2 C32.2 C33.2 C34.2 C35.2 C36.2 C37.2 C38.2 C39.2 C40.2 C41.2 C42.2 LED1.2(Cathode) LED2.2(Cathode) LED3.2(Cathode) LED4.2(Cathode) LED5.2(Cathode) P1.2 P6.1 P6.2 P6.3 P6.4 P6.5 P6.6 P7.1 P7.2 P7.3 P7.4 R2.1 U1.1(GND) U2.2(GND) U3.1(GND) U4.1(GND) U5.5(GND) U5.13(GND) U5.14(GND) U5.53(GNDPLL0) U5.59(GND) U5.69(GND) U5.86(GND) U5.103(GND) U5.127(GNDPLL1) U5.132(GND) U5.140(GND) U9.4(GND)
ICE_Debug0: R23.1
ICE_Debug1: R22.1
ICE_Debug2: R21.1
LCD_AVCC_5V25: C2.2 C3.2 R1.2 TP2.1 U2.5(Vout)
LCD_VDD_2V5: C12.2 C13.2 C27.1 C29.1 C33.1 C35.1 D3.1(Anode) TP4.1 U4.4(Vout) U5.89(VCCIO_1) U5.100(VCCIO_1) U5.123(VCCIO_0) U5.131(VCCIO_0)
VCC_1V2: C1.1 C28.1 C31.1 C34.1 C36.1 C41.1 C42.1 TP1.1 U1.2(Vout) U5.27(VCC) U5.40(VCC) U5.54(VCCPLL0) U5.92(VCC) U5.111(VCC) U5.126(VCCPLL1)
VCC_3V3: C11.1 C21.2 C32.1 C37.1 C38.1 C39.1 C40.1 R3.1 R14.2 R15.2 R17.2 R18.2 R26.1 R27.1 TP3.1 U3.2(Vout) U5.6(VCCIO_3) U5.30(VCCIO_3) U5.46(VCCIO_2) U5.57(VCCIO_2) U5.72(VCC_SPI) U9.8(VCC)
VCC_PWR: P1.1 R32.1 R33.1 R34.1 R35.2
FIFO_D0: U5.62(IOB_102)
FIFO_D1: U5.61(IOB_96)
FIFO_D2: U5.60(IOB_95)
FIFO_D3: U5.56(IOB_94)
FIFO_D4: U5.55(IOB_91)
FIFO_D5: U5.49(IOB_81_GBIN5)
FIFO_D6: U5.48(IOB_80)
FIFO_D7: U5.47(IOB_79)
FIFO_D8: U5.45(IOB_73)
FIFO_D9: U5.44(IOB_72)
FIFO_D10: U5.43(IOB_71)
FIFO_D11: U5.42(IOB_64)
FIFO_D12: U5.41(IOB_63)
FIFO_D13: U5.39(IOB_61)
FIFO_D14: U5.38(IOB_57)
FIFO_D15: U5.37(IOB_56)
FLASH_MISO: P2.2 U9.2(SDO)
FLASH_MOSI: P2.3 U9.5(SDI)
ICE_CDONE: LED5.1(Anode) R26.2 U5.65(CDONE)
ICE_CLK: U5.52(IOB_82_GBIN4)
ICE_CREST: R27.2 U5.66(CRESET_B)
ICE_MISO: P2.1 U5.67(IOB_105_SDO)
ICE_MOSI: P2.4 U5.68(IOB_106_SDI)
ICE_SCK: R18.1 U5.70(IOB_107_SCK) U9.6(SCK)
ICE_SS_B: P3.1 U5.71(IOB_108_SS_B)
NetC4_1: C4.1 R32.2 U1.3(Vin)
NetC5_2: C5.2 C6.2 R35.1 U2.1(Vin) U2.3(Enable)
NetC7_2: C7.2 R1.1 R2.2 U2.4(ADJ)
NetC8_2: C8.2 C10.2 R34.2 U4.3(Vin)
NetC9_1: C9.1 R33.2 U3.3(Vin)
NetC30_1: C30.1 D3.2(Cathode) U5.108(VPP_2V5)
NetLED1_1: LED1.1(Anode) R3.2
NetLED2_1: LED2.1(Anode) R21.2
NetLED3_1: LED3.1(Anode) R22.2
NetLED4_1: LED4.1(Anode) R23.2
NetP3_2: P3.2 R14.1 U9.1(~{CS})
NetR15_1: R15.1 U9.7(~{HOLD})
NetR17_1: R17.1 U9.3(~{WP})
NetTP8_1: TP8.1 U5.63(IOB_103_CBSEL0)
NetTP9_1: TP9.1 U5.64(IOB_104_CBSEL1)

Not connected (* = marked no-connect by the designer): U5 35(NC)* 36(NC)* 50(NC)* 51(NC)* 58(NC)* 77(NC)* 109(VPP_FAST)* 133(NC)*

### Notes on the sheet
- PWR 3Amps trace width <https://www.4pcb.com/trace-width-calculator.html>
- (in symbol ICE40HX4K-TQ144, part C) BANK 2

### Library data of the parts
C1 C4 C9 C11 = Cap_4.7uF: Multilayer Ceramic Capacitors MLCC - SMD/SMT 6.3V 4.7uF 0603 X5R 10%; Manufacture No.: C0603C475K9P7411; Component Name: Cap; Created By: Daoming Dong; Date Created: 01-Mar-2019; Mouser No.: 80-C0603C475K9P7411; Package: 0603; Datasheet URL.: https://www.mouser.co.uk/datasheet/2/212/KEM_C1006_X5R_SMD-1103249.pdf
C2 C6 C8 C13 = Cap_10uF: Multilayer Ceramic Capacitors MLCC - SMD/SMT 0603 6.3V 10uF X5R 10% Soft Term; Name: Cap; Created By: Daoming Dong; Date Created: 01-Mar-2019; Mouser No.: 810-C1608X5R0J106KE; Manufacture No.: C1608X5R0J106K080AE; Datasheet URL.: https://www.mouser.co.uk/datasheet/2/400/lcc_commercial_soft_en-520032.pdf; Package: 0603
C3 C5 C10 C12 C27-C42 = Cap_0.1uF: as C26 on sheet FT601; Date Created: 01-Mar-2019; Created By: Daoming Dong; Datasheet URL: https://www.mouser.co.uk/datasheet/2/447/UPY-AC_NP0X7R_16V-to-630V_11-1511105.pdf; Package: 0603; Manufacture No.: AC0603KRX7R9BB104; Mouser No.: 603-AC0603KR9BB104
C7 = Cap_470pF: Multilayer Ceramic Capacitors MLCC - SMD/SMT 25V 470pF X7R 0402 10% AEC-Q200; Manufacture: KEMET; Date Created: 13-Mar-2019; Created By: Daoming Dong; Manufacture No.: C0402S471K3RACAUTO; Mouser No.: 80-C0402S471K3RAUTO; Datasheet URL.: https://www.mouser.co.uk/datasheet/2/212/KEM_C1014_X7R_FE-CAP_SMD-1102761.pdf; Case Code: 0603
C21 = Cap_0.1uF: as C14 on sheet FPGA_SLM; Date Created: 01-Mar-2019; Created By: Daoming Dong; Datasheet URL: https://www.mouser.co.uk/datasheet/2/447/UPY-AC_NP0X7R_16V-to-630V_11-1511105.pdf; Package: 0603; Manufacture No.: AC0603KRX7R9BB104; Mouser No.: 603-AC0603KR9BB104
D3 = SDiode_CDBU0520: Schottky Diodes & Rectifiers VR=20V, IO=500mA; Manufacture: Comchip Technology; Manufacture No.: CDBU0520; Mouser No.: 750-CDBU0520; Case Code: 0603; Created By: Daoming Dong; Date Created: 03-May-2019; Datasheet URL.: https://www.mouser.co.uk/datasheet/2/80/CDBU0520-HF-RevA797161-1481024.pdf
LED1-LED5 = LED_RED: as LED6 on sheet FT601; Created By: Daoming Dong; Date Created: 11-Mar-2018; Manufacture No.: TLMS1000-GS08; Mouser No.: 78-TLMS1000; Case Code: 0603; Datasheet URL.: https://www.mouser.co.uk/datasheet/2/427/tlmb1100-279843.pdf
P1 P3 = Header 2: Header, 2-Pin; LatestRevisionDate: 17-Jul-2002; LatestRevisionNote: Re-released for DXP Platform.; Publisher: Altium Limited
P2 P7 = Header 4: Header, 4-Pin; LatestRevisionDate: 17-Jul-2002; LatestRevisionNote: Re-released for DXP Platform.; Publisher: Altium Limited
P6 = Header 3X2: Header, 3-Pin, Dual row; LatestRevisionDate: 17-Jul-2002; LatestRevisionNote: Re-released for DXP Platform.; Publisher: Altium Limited
R1 = Res_680: Thin Film Resistors - SMD 680 ohm 1% 50 ppm Thin Film; Manufacture: Yageo; Manufacture No.: RT0603FRE13680RL; Mouser No.: 603-RT0603FRE13680RL; Created By: Daoming Dong; Date Created: 02-Mar-2019; Datasheet URL.: https://www.mouser.co.uk/datasheet/2/447/PYu-RT_1-to-0.01_RoHS_L_9-1222720.pdf; Case Code: 0603
R2 = Res_2.2K: Thick Film Resistors - SMD 1/10Watt 2.2Kohms 5% Commercial Use; Manufacture: Vishay; Manufacture No.: CRCW06032K20JNEAC; Mouser No.: 71-CRCW06032K20JNEAC; Created By: Daoming Dong; Date Created: 02-Mar-2019; Case Code: 0603; Datasheet URL.: https://www.mouser.co.uk/datasheet/2/427/crcwce3-1223726.pdf
R3 R21-R23 R26 = Res_680: as R36 on sheet FT601; Manufacture No.: RT0603FRE13680RL; Mouser No.: 603-RT0603FRE13680RL; Created By: Daoming Dong; Date Created: 02-Mar-2019; Datasheet URL.: https://www.mouser.co.uk/datasheet/2/447/PYu-RT_1-to-0.01_RoHS_L_9-1222720.pdf; Case Code: 0603
R14 R15 R17 R18 = Res_10K: as R9 on sheet FT601; Manufacture No.: RT0603WRE0710KL; Mouser No.: 603-RT0603WRE0710KL; Created By: Daoming Dong; Date Created: 02-Mar-2019; Datasheet URL.: https://www.mouser.co.uk/datasheet/2/447/PYu-RT_1-to-0.01_RoHS_L_9-1222720.pdf; Case Code: 0603
R27 = Res_10K: as R39 on sheet FT601; Manufacture No.: RT0603WRE0710KL; Mouser No.: 603-RT0603WRE0710KL; Created By: Daoming Dong; Date Created: 02-Mar-2019; Datasheet URL.: https://www.mouser.co.uk/datasheet/2/447/PYu-RT_1-to-0.01_RoHS_L_9-1222720.pdf; Case Code: 0603
R32-R35 = Res_0: as R30 on sheet FT601; Case Code: 0603; Manufacture No.: CRCW06030000Z0EAC; Mouser No.: 71-CRCW06030000Z0EAC; Created By: Daoming Dong; Date Created: 02-Mar-2019; Datasheet URL.: https://www.mouser.co.uk/datasheet/2/427/crcwce3-1223726.pdf
TP1-TP4 TP8 TP9 = Testpoint: Testpoint for testing voltage; Created By: Daoming Dong; Date Created: 11-Mar-2019
U1 = MIC_LDO_1V2: LDO Voltage Regulators 250mA Adj LDO 2%; Manufacture: Microchip; Component Name: LDO 1.2V; Created By: Daoming Dong; Date Created: 13-Mar-2019; Manufacture No.: MCP1700T-1202E/TT; Mouser No.: 579-MCP1700T1202E/TT; Datasheet URL.: https://www.mouser.co.uk/datasheet/2/268/MCP1700-Low-Quiescent-Current-LDO-20001826E-737536.pdf
U2 = MIC5205YM5: LDO Voltage Regulators 150mA 1% Low Noise LDO; Manufacture: Microchip Technology; Manufacture No.: MIC5205YM5-TR; Mouser No.: 998-MIC5205YM5TR; Datasheet URL.: https://www.mouser.co.uk/datasheet/2/268/mic5205-778789.pdf; Created By: Daoming Dong; Date Created: 11-Mar-2019
U3 = MIC_LDO_3V3: 3.3v LDO Voltage Regulators 250mA Adj LDO 2%; Manufacture: Microchip; Manufacture No.: MCP1700T-3302E/TT; Mouser No.: 579-MCP1700T3302E/TT; Date Created: 14-Mar-2019; Created By: Daoming Dong; Datasheet URL.: https://www.mouser.co.uk/datasheet/2/268/MCP1700-Low-Quiescent-Current-LDO-20001826E-737536.pdf; Component Name: LDO
U4 = LDO_2V5: LDO Voltage Regulators 800mA LDO Linear Reg; Manufacture: Texas Instruments; Manufacture No.: LM1117MP-2.5/NOPB; Mouser No.: 926-LM1117MP-2.5/NOPB; Created By: Daoming Dong; Date Created: 05-Mar-2019; Datasheet URL.: http://www.ti.com/general/docs/suppproductinfo.tsp?distId=26&gotoUrl=http%3A%2F%2Fwww.ti.com%2Flit%2Fds%2Fsymlink%2Flm1117.pdf
U5 = ICE40HX4K-TQ144: as U5 on sheet FPGA_SLM; DatasheetVersion: Rev. 02.9; PackageVersion: Rev. 03.9, 02/2013; PackageReference: TQFP-144; PackageDescription: 144-Pin Thin Quad Flat Package, Body 20 x 20 mm, Pitch 0.5 mm; Supplier 1: Digi-Key; Supplier Part Number 1: 220-1572-ND; Supplier 2: Mouser; Supplier Part Number 2: 842-ICE40HX4K-TQ144; Packing: Tray; RoHS: TRUE; Mounting Technology: Surface Mount; PartNumber: ICE40HX4K-TQ144; ComponentLink1Description: Manufacturer URL; ComponentLink1URL: http://www.latticesemi.com/en; ComponentLink2Description: Datasheet; ComponentLink2URL: http://www.latticesemi.com/~/media/Documents/DataSheets/iCE/iCE40LPHXFamilyDataSheet.pdf; ComponentLink3Description: Package Specification; ComponentLink3URL: http://www.latticesemi.com/lit/docs/package/pkg.pdf
U9 = Flash: NOR Flash SPI FLASH NOR SLC 32MX4 SOIC; Manufacture: Micron; Created By: Daoming Dong; Date Created: 05-Mar-2019; Mouser No.: 340-224871-REEL; Manufacture No.: MT25QL128ABA1ESE-0SIT TR; Datasheet URL.: https://www.mouser.co.uk/datasheet/2/671/MT25Q_QLHS_L_128_ABA_0-1287003.pdf

## Nets that join several sheets
GND: FT601 (40 pins), FPGA_SLM (23 pins), FPGA_Power_SPI (63 pins)
ICE_Debug0: FPGA_SLM (U5.83), FPGA_Power_SPI (R23.1)
ICE_Debug1: FPGA_SLM (U5.84), FPGA_Power_SPI (R22.1)
ICE_Debug2: FPGA_SLM (U5.85), FPGA_Power_SPI (R21.1)
LCD_AVCC_5V25: FPGA_SLM (J3.2 J3.4), FPGA_Power_SPI (5 pins)
LCD_VDD_2V5: FPGA_SLM (6 pins), FPGA_Power_SPI (13 pins)
VCC_3V3: FT601 (21 pins), FPGA_SLM (C14.2 R25.2 X1.1 X1.4), FPGA_Power_SPI (22 pins)
FIFO_CLK: FT601 (R4.2), FPGA_SLM (U5.21)
FIFO_D0: FT601 (RN8.9), FPGA_Power_SPI (U5.62)
FIFO_D1: FT601 (RN8.10), FPGA_Power_SPI (U5.61)
FIFO_D2: FT601 (RN8.11), FPGA_Power_SPI (U5.60)
FIFO_D3: FT601 (RN8.12), FPGA_Power_SPI (U5.56)
FIFO_D4: FT601 (RN8.13), FPGA_Power_SPI (U5.55)
FIFO_D5: FT601 (RN8.14), FPGA_Power_SPI (U5.49)
FIFO_D6: FT601 (RN8.15), FPGA_Power_SPI (U5.48)
FIFO_D7: FT601 (RN8.16), FPGA_Power_SPI (U5.47)
FIFO_D8: FT601 (RN7.9), FPGA_Power_SPI (U5.45)
FIFO_D9: FT601 (RN7.10), FPGA_Power_SPI (U5.44)
FIFO_D10: FT601 (RN7.11), FPGA_Power_SPI (U5.43)
FIFO_D11: FT601 (RN7.12), FPGA_Power_SPI (U5.42)
FIFO_D12: FT601 (RN7.13), FPGA_Power_SPI (U5.41)
FIFO_D13: FT601 (RN7.14), FPGA_Power_SPI (U5.39)
FIFO_D14: FT601 (RN7.15), FPGA_Power_SPI (U5.38)
FIFO_D15: FT601 (RN7.16), FPGA_Power_SPI (U5.37)
FIFO_D16: FT601 (RN4.9), FPGA_SLM (U5.34)
FIFO_D17: FT601 (RN4.10), FPGA_SLM (U5.33)
FIFO_D18: FT601 (RN4.11), FPGA_SLM (U5.32)
FIFO_D19: FT601 (RN4.12), FPGA_SLM (U5.31)
FIFO_D20: FT601 (RN4.13), FPGA_SLM (U5.29)
FIFO_D21: FT601 (RN4.14), FPGA_SLM (U5.28)
FIFO_D22: FT601 (RN4.15), FPGA_SLM (U5.26)
FIFO_D23: FT601 (RN4.16), FPGA_SLM (U5.25)
FIFO_D24: FT601 (RN3.9), FPGA_SLM (U5.24)
FIFO_D25: FT601 (RN3.10), FPGA_SLM (U5.23)
FIFO_D26: FT601 (RN3.11), FPGA_SLM (U5.22)
FIFO_D27: FT601 (RN3.12), FPGA_SLM (U5.20)
FIFO_D28: FT601 (RN3.13), FPGA_SLM (U5.19)
FIFO_D29: FT601 (RN3.14), FPGA_SLM (U5.18)
FIFO_D30: FT601 (RN3.15), FPGA_SLM (U5.17)
FIFO_D31: FT601 (RN3.16), FPGA_SLM (U5.16)
FT_GPIO0: FT601 (P4.3), FPGA_SLM (U5.11)
FT_GPIO1: FT601 (P8.3), FPGA_SLM (U5.12)
FT_OE: FT601 (RN5.14), FPGA_SLM (U5.2)
FT_RD: FT601 (RN5.13), FPGA_SLM (U5.3)
FT_RESET: FT601 (P11.3), FPGA_SLM (U5.10)
FT_RXF: FT601 (RN5.10), FPGA_SLM (U5.8)
FT_SIWU: FT601 (P9.3), FPGA_SLM (U5.7)
FT_TXE: FT601 (RN5.9), FPGA_SLM (U5.9)
FT_WR: FT601 (P10.3), FPGA_SLM (U5.4)
ICE_Debug7: FT601 (P12.2), FPGA_SLM (U5.15)
ICE_Debug8: FT601 (P13.2), FPGA_SLM (U5.1)